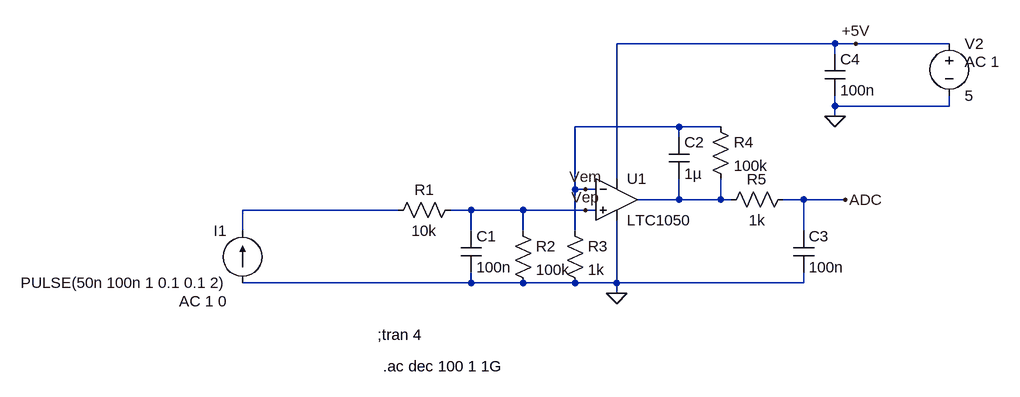
[diagram p0: schematic Draft2.asc]
Draft2.asc, the LTspice schematic file:
Version 4
SHEET 1 1168 680
WIRE 912 -160 576 -160
WIRE 944 -160 912 -160
WIRE 1088 -160 944 -160
WIRE 912 -144 912 -160
WIRE 912 -64 912 -80
WIRE 1088 -64 1088 -80
WIRE 1088 -64 912 -64
WIRE 912 -48 912 -64
WIRE 672 -32 512 -32
WIRE 736 -32 672 -32
WIRE 672 -16 672 -32
WIRE 576 48 576 -160
WIRE 512 64 512 -32
WIRE 528 64 512 64
WIRE 544 64 528 64
WIRE 672 80 672 48
WIRE 672 80 608 80
WIRE 736 80 736 48
WIRE 736 80 672 80
WIRE 752 80 736 80
WIRE 864 80 832 80
WIRE 928 80 864 80
WIRE 240 96 0 96
WIRE 352 96 320 96
WIRE 432 96 352 96
WIRE 528 96 432 96
WIRE 544 96 528 96
WIRE 0 128 0 96
WIRE 352 128 352 96
WIRE 432 128 432 96
WIRE 512 128 512 64
WIRE 864 128 864 80
WIRE 352 208 352 192
WIRE 352 208 0 208
WIRE 432 208 352 208
WIRE 512 208 432 208
WIRE 576 208 576 112
WIRE 576 208 512 208
WIRE 864 208 864 192
WIRE 864 208 576 208
WIRE 576 224 576 208
FLAG 576 224 0
FLAG 912 -48 0
FLAG 928 80 ADC
FLAG 944 -160 +5V
FLAG 528 64 Vem
FLAG 528 96 Vep
SYMBOL res 336 80 R90
WINDOW 0 0 56 VBottom 2
WINDOW 3 32 56 VTop 2
SYMATTR InstName R1
SYMATTR Value 10k
SYMBOL cap 336 128 R0
SYMATTR InstName C1
SYMATTR Value 100n
SYMBOL res 416 112 R0
SYMATTR InstName R2
SYMATTR Value 100k
SYMBOL res 496 112 R0
SYMATTR InstName R3
SYMATTR Value 1k
SYMBOL OpAmps\\LTC1050 576 16 R0
SYMATTR InstName U1
SYMBOL cap 656 -16 R0
SYMATTR InstName C2
SYMATTR Value 1µ
SYMBOL res 720 -48 R0
SYMATTR InstName R4
SYMATTR Value 100k
SYMBOL res 848 64 R90
WINDOW 0 0 56 VBottom 2
WINDOW 3 32 56 VTop 2
SYMATTR InstName R5
SYMATTR Value 1k
SYMBOL cap 848 128 R0
SYMATTR InstName C3
SYMATTR Value 100n
SYMBOL cap 896 -144 R0
SYMATTR InstName C4
SYMATTR Value 100n
SYMBOL voltage 1088 -176 R0
WINDOW 123 24 44 Left 2
WINDOW 39 0 0 Left 0
SYMATTR InstName V2
SYMATTR Value 5
SYMATTR Value2 AC 1
SYMBOL current 0 208 R180
WINDOW 0 24 80 Left 2
WINDOW 3 24 0 Left 2
WINDOW 123 24 -28 Left 2
WINDOW 39 0 0 Left 0
SYMATTR InstName I1
SYMATTR Value PULSE(50n 100n 1 0.1 0.1 2)
SYMATTR Value2 AC 1 0
TEXT 208 288 Left 2 !;tran 4
TEXT 216 336 Left 2 !.ac dec 100 1 1G

The netlist it stands for:
* Draft2.asc
R1 Vep N002 10k
C1 Vep 0 100n
R2 Vep 0 100k
R3 Vem 0 1k
XU1 Vep Vem +5V 0 N001 LTC1050  ; pins In+ In- V+ V- OUT
C2 Vem N001 1µ
R4 Vem N001 100k
R5 ADC N001 1k
C3 ADC 0 100n
C4 +5V 0 100n
V2 +5V 0 5 AC 1
I1 0 N002 PULSE(50n 100n 1 0.1 0.1 2) AC 1 0
;tran 4
.ac dec 100 1 1G
.lib LTC.lib
.backanno
.end